# EAGLE design v1 (EAGLE 7.3.0)
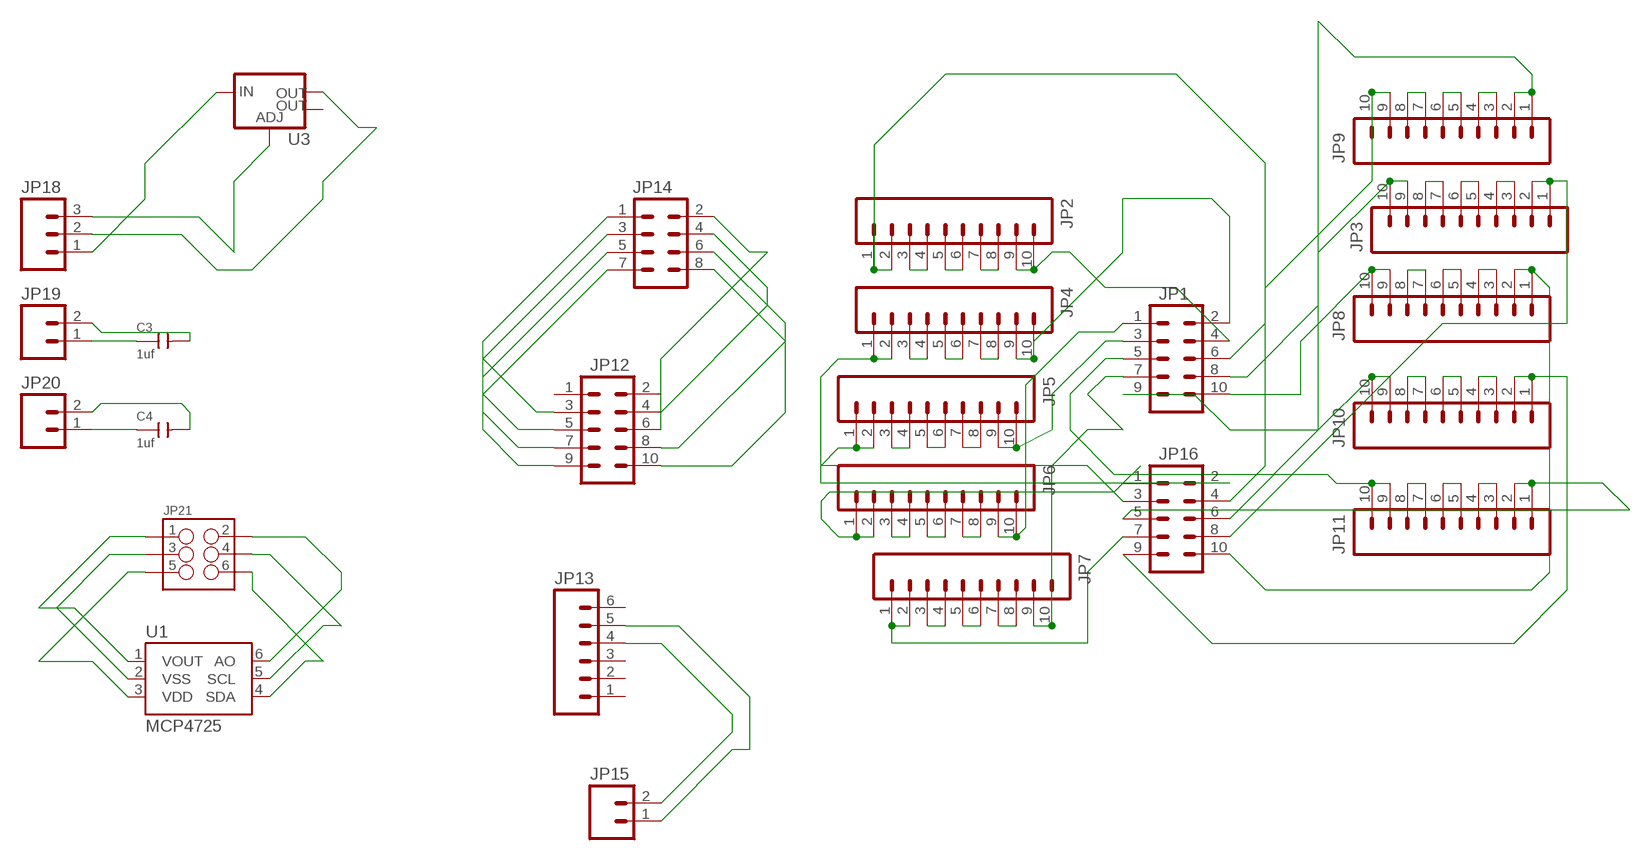
[diagram p0: schematic, sheet 1]

## Parts
C3  1uf  CERAMIC-1UF-25V-10%-X7R(0805)  [C0805]
C4  1uf  CERAMIC-1UF-25V-10%-X7R(0805)  [C0805]
JP1  M05X2PTH  [AVR_ICSP]
JP2  M10SILK_FEMALE_PTH  [1X10]
JP3  M10SILK_FEMALE_PTH  [1X10]
JP4  M10SILK_FEMALE_PTH  [1X10]
JP5  M10SILK_FEMALE_PTH  [1X10]
JP6  M10SILK_FEMALE_PTH  [1X10]
JP7  M10SILK_FEMALE_PTH  [1X10]
JP8  M10SILK_FEMALE_PTH  [1X10]
JP9  M10SILK_FEMALE_PTH  [1X10]
JP10  M10SILK_FEMALE_PTH  [1X10]
JP11  M10SILK_FEMALE_PTH  [1X10]
JP12  M05X2PTH  [AVR_ICSP]
JP13  M06SILK_FEMALE_PTH  [1X06]
JP14  M04X2  [2X4]
JP15  M02PTH  [1X02]
JP16  M05X2PTH  [AVR_ICSP]
JP18  M03PTH  [1X03]
JP19  M02PTH  [1X02]
JP20  M02PTH  [1X02]
JP21  M03X22X3_SILK_MALE_PTH  [2X3]
U1  MCP4725  MCP4725SOT-23  [SOT23-6]
U3  V_REG_LM1117SOT223  [SOT223]

## Nets
N$1: JP2.3 JP2.4
N$2: JP1.2 JP4.9 JP4.10
N$3: JP1.3 JP5.9 JP5.10
N$4: JP1.1 JP6.9 JP6.10
N$5: JP1.9 JP10.9 JP10.10
N$6: JP1.5 JP11.9 JP11.10
N$7: JP3.1 JP3.2 JP16.8
N$8: JP1.8 JP3.9 JP3.10
N$9: JP1.7 JP7.9 JP7.10
N$10: JP1.6 JP9.9 JP9.10
N$11: JP9.7 JP9.8
N$12: JP9.5 JP9.6
N$13: JP9.3 JP9.4
N$14: JP9.1 JP9.2 JP16.6
N$15: JP3.7 JP3.8
N$16: JP3.5 JP3.6
N$17: JP3.3 JP3.4
N$18: JP21.2 U1.6(AO)
N$19: JP10.1 JP10.2 JP16.9
N$20: JP8.3 JP8.4
N$21: JP8.5 JP8.6
N$22: JP8.7 JP8.8
N$23: JP11.7 JP11.8
N$24: JP11.5 JP11.6
N$25: JP11.3 JP11.4
N$26: JP6.1 JP6.2 JP16.1
N$27: JP21.4 U1.5(SCL)
N$28: JP10.3 JP10.4
N$29: JP10.5 JP10.6
N$30: JP10.7 JP10.8
N$31: JP5.7 JP5.8
N$32: JP5.5 JP5.6
N$33: JP5.1 JP5.2 JP16.3
N$34: JP5.3 JP5.4
N$35: JP21.6 U1.4(SDA)
N$36: JP6.3 JP6.4
N$37: JP6.5 JP6.6
N$38: JP6.7 JP6.8
N$39: JP7.1 JP7.2 JP16.7
N$40: JP7.3 JP7.4
N$41: JP7.5 JP7.6
N$42: JP7.7 JP7.8
N$43: JP4.1 JP4.2 JP16.2
N$44: JP4.3 JP4.4
N$45: JP4.5 JP4.6
N$46: JP4.7 JP4.8
N$47: JP11.1 JP11.2 JP16.5
N$48: JP2.7 JP2.8
N$49: JP2.5 JP2.6
N$50: JP2.1 JP2.2 JP16.4
N$51: JP1.10 JP8.9 JP8.10
N$52: JP21.5 U1.3(VDD)
N$53: JP21.3 U1.2(VSS)
N$54: JP1.4 JP2.9 JP2.10
N$55: JP13.4 JP15.2
N$56: JP13.5 JP15.1
N$57: JP12.4 JP14.2
N$58: JP12.6 JP14.4
N$59: JP12.8 JP14.6
N$60: JP12.10 JP14.8
N$61: JP12.3 JP14.1
N$62: JP12.5 JP14.3
N$63: JP12.7 JP14.5
N$64: JP12.9 JP14.7
N$65: JP21.1 U1.1(VOUT)
N$66: JP18.3 U3.1(ADJ)
N$67: JP8.1 JP8.2 JP16.10
N$68: C3.1 JP19.1
N$69: C3.2 JP19.2
N$70: C4.1 JP20.1
N$71: C4.2 JP20.2
N$72: JP18.2 U3.2(OUT)
N$73: JP18.1 U3.3(IN)
Unconnected: JP12.1 JP12.2 JP13.1 JP13.2 JP13.3 JP13.6 U3.4(OUT)

## Library data of the parts
C3 C4 = Seeed-OPL-Capacitor:CERAMIC-1UF-25V-10%-X7R(0805): 302010179; MPN: CC0805KKX7R8BB105
JP1 JP12 JP16 = SparkFun-Connectors:M05X2: Header 5x2 Standard 10-pin dual row 0.1" header. Commonly used with AVR-ISP. Use with Spark Fun Electronics SKU: PRT-00778
JP2-JP11 = SparkFun-Connectors:M10: Header 10 Standard 10-pin 0.1" header. Use with straight break away headers (SKU : PRT-00116), right angle break away headers (PRT-00553), swiss pins (PRT-00743), machine pins (PRT-00117), and female headers (PRT-00115).; PROD_ID: CONN-11563
JP13 = SparkFun-Connectors:M06: Header 6 Standard 6-pin 0.1" header. Use with straight break away headers (SKU : PRT-00116), right angle break away headers (PRT-00553), swiss pins (PRT-00743), machine pins (PRT-00117), and female headers (PRT-00115). Molex polarized connector foot print use with SKU : PRT-08094 with associated crimp pins and housings. NOTES ON THE VARIANTS LOCK and LOCK_LONGPADS... This footprint was designed to help hold the alignment of a through-hole component (i.e. 6-pin header) while soldering it into place. You may notice that each hole has been shifted either up or down by 0.005 of an inch from it's more standard position (which is a perfectly straight line). This slight alteration caused the pins (the squares in the middle) to touch the edges of the holes. Because they are alternating, it causes a "brace" to hold the component in place. 0.005 has proven to be the perfect amount of "off-center" position when using our standard breakaway headers. Although looks a little odd when you look at the bare footprint, once you have a header in there, the alteration is very hard to notice. Also,if you push a header all the way into place, it is covered up entirely on the bottom side. This idea of altering the position of holes to aid alignment will be further integrated into the Sparkfun Library for other footprints. It can help hold any component with 3 or more connection pins.; PROD_ID: CONN-08437
JP14 = SparkFun-Connectors:M04X2: .1" header, two rows of four.
JP15 JP19 JP20 = SparkFun-Connectors:M02: Standard 2-pin 0.1" header. Use with - straight break away headers ( PRT-00116) - right angle break away headers (PRT-00553) - swiss pins (PRT-00743) - machine pins (PRT-00117) - female headers (PRT-00115) Molex polarized connector foot print use with: PRT-08233 with associated crimp pins and housings. 2.54_SCREWTERM for use with PRT-10571. 3.5mm Screw Terminal footprints for PRT-08084 5mm Screw Terminal footprints for use with PRT-08432
JP18 = SparkFun-Connectors:M03: Header 3 Standard 3-pin 0.1" header. Use with straight break away headers (SKU : PRT-00116), right angle break away headers (PRT-00553), swiss pins (PRT-00743), machine pins (PRT-00117), and female headers (PRT-00115). Molex polarized connector foot print use with SKU : PRT-08232 with associated crimp pins and housings.
JP21 = SparkFun-Connectors:M03X2: 2x3 .1" header. Shrouded, with keying- CONN-10681 SMT- CONN-11415 Pogo pins- HW-11044; PROD_ID: CONN-09701
U1 = SparkFun-AnalogIC:MCP4725: Microchip 12-bit I2C DAC, SOT23-6; PROD_ID: IC-08886
U3 = SparkFun-PowerIC:V_REG_LM1117: Voltage Regulator LM1117 Standard adjustable voltage regulator but in SMD form. Spark Fun Electronics SKU : COM-00595; PROD_ID: VREG-08170

## Board
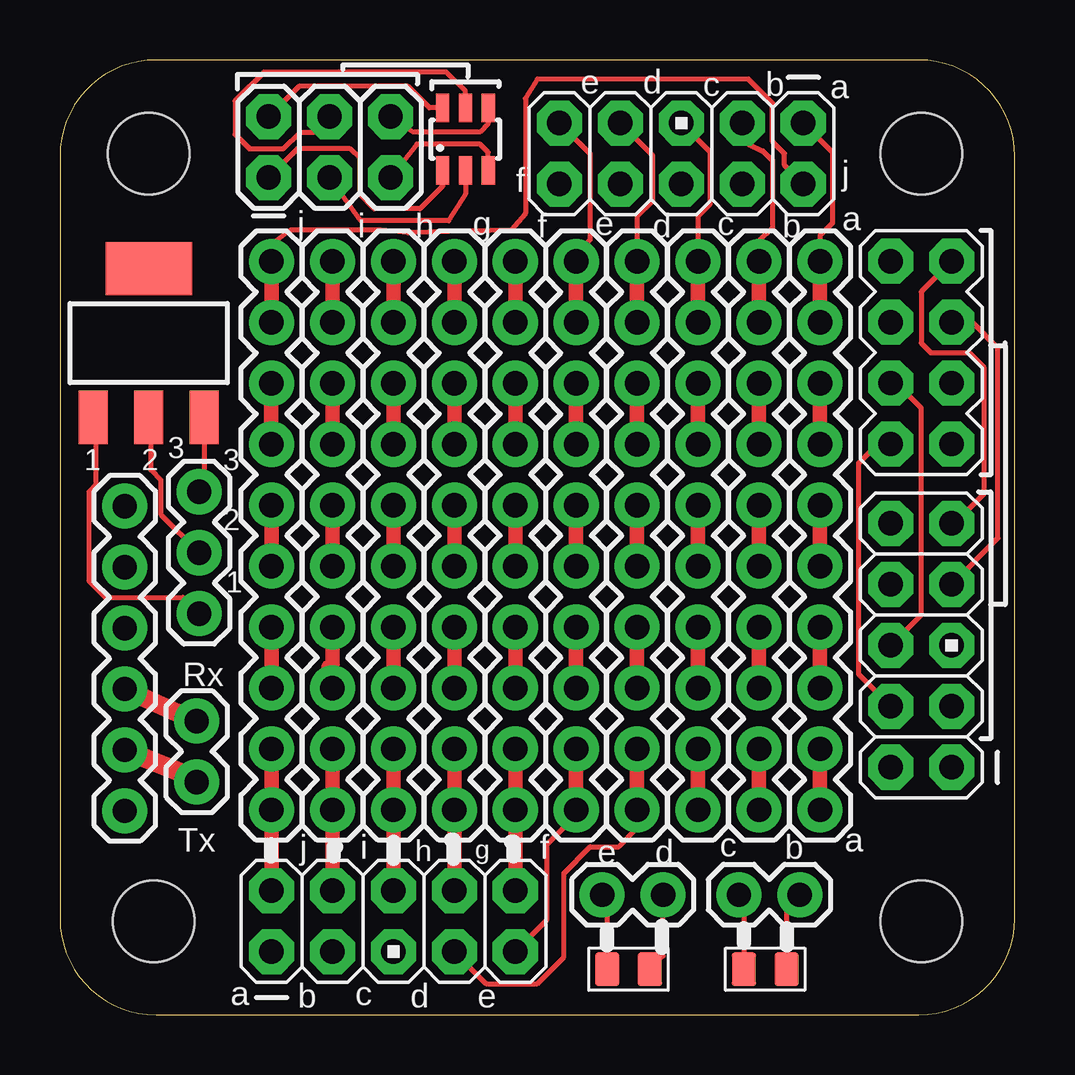
[diagram p1: board, top side]
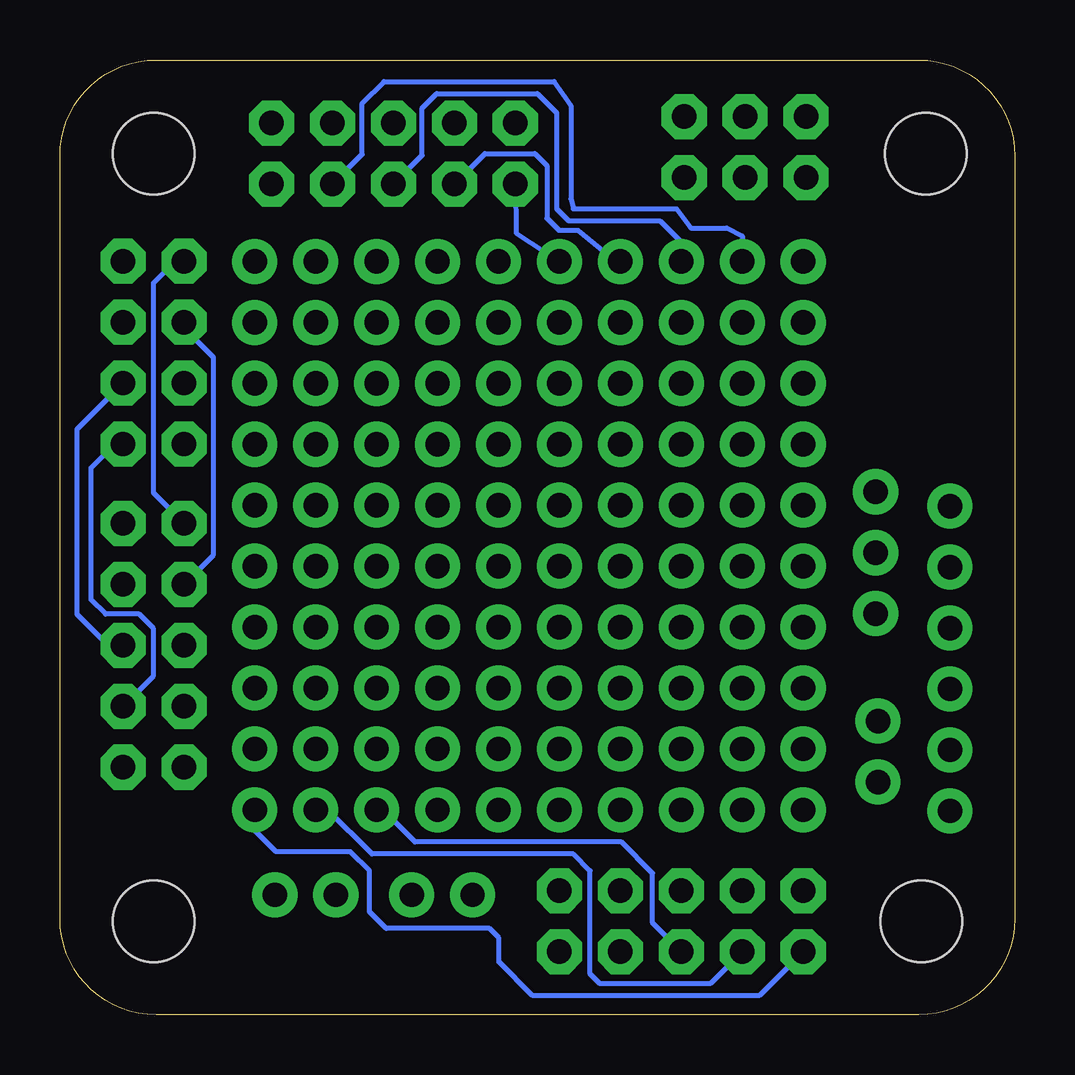
[diagram p2: board, bottom side, seen from below]

Size 39.8 x 39.8 mm. Coordinates in mm from the lower left corner, seen from the top.
Outline: 39.8,4 39.8,35.8 arc90 35.8,39.8 4,39.8 arc90 0,35.8 0,4 arc90 4,0 35.8,0 arc90 39.8,4
Copper layers (1*16): Top 0.035mm / dielectric 1.5mm / Bottom 0.035mm
Design rules "DFRobot_Eagle_Rule_v0.4": minimum track width 6mil, minimum drill 12mil, track to track 6mil, track to pad 6mil, pad to pad 6mil, via to via 6mil, smd to smd 0mil, copper to edge 10mil, drill to drill 10mil, minimum pad ring 12mil, minimum via ring 8mil, stop-mask expansion 2mil, vias tented up to drill 25mil, thermal gap 10mil
Holes 3.4 mm at 3.9,3.9 35.9,3.9 3.7,35.9 35.9,35.9

### Footprints (pad centres in the part's own frame; a part is rotated, then mirrored left to right if it is on the bottom)
C0805 = smd 1.397 x 1.016: 1 0,0.889; 2 0,-0.889
AVR_ICSP = drill 1.016 pad 1.88 octagon: 1 -1.27,5.08; 2 1.27,5.08; 3 -1.27,2.54; 4 1.27,2.54; 5 -1.27,0; 6 1.27,0; 7 -1.27,-2.54; 8 1.27,-2.54; 9 -1.27,-5.08; 10 1.27,-5.08
1X10 = drill 1.016 pad 1.88: 1 0,0; 2 2.54,0; 3 5.08,0; 4 7.62,0; 5 10.16,0; 6 12.7,0; 7 15.24,0; 8 17.78,0; 9 20.32,0; 10 22.86,0
1X06 = drill 1.016 pad 1.88: 1 0,0; 2 2.54,0; 3 5.08,0; 4 7.62,0; 5 10.16,0; 6 12.7,0
2X4 = drill 1.016 pad 1.88 octagon: 1 -3.81,-1.27; 2 -3.81,1.27; 3 -1.27,-1.27; 4 -1.27,1.27; 5 1.27,-1.27; 6 1.27,1.27; 7 3.81,-1.27; 8 3.81,1.27
1X02 = drill 1.016 pad 1.88: 1 0,0; 2 2.54,0
1X03 = drill 1.016 pad 1.88: 1 0,0; 2 2.54,0; 3 5.08,0
2X3 = drill 1.016 pad 1.88 octagon: 1 0,0; 2 0,2.54; 3 2.54,0; 4 2.54,2.54; 5 5.08,0; 6 5.08,2.54
SOT23-6 = smd 0.55 x 1.2: 1 0.95,1.3; 2 0,1.3; 3 -0.95,1.3; 4 -0.95,-1.3; 5 0,-1.3; 6 0.95,-1.3
SOT223 = smd 1.219 x 2.235: 1 -2.311,-3.099; 2 0,-3.099; 3 2.311,-3.099 | smd 3.6 x 2.2: 4 0,3.099

### Placement (x,y rotation side)
C3  29.4,1.9 90 top
C4  23.7,1.9 90 top
JP1  13.9,3.9 90 top
JP2  11.36,31.4 270 top
JP3  16.44,31.4 270 top
JP4  8.82,31.4 270 top
JP5  29.14,31.4 270 top
JP6  31.68,31.4 270 top
JP7  24.06,31.4 270 top
JP8  18.98,31.4 270 top
JP9  13.9,31.4 270 top
JP10  21.52,31.4 270 top
JP11  26.6,31.4 270 top
JP12  35.9,15.4 180 top
JP13  2.7,21.2 270 top
JP14  35.9,27.6 90 top
JP15  5.7,9.7 90 top
JP16  25.9,35.9 270 top
JP18  5.8,21.8 270 top
JP19  28.3,5 0 top
JP20  22.6,5 0 top
JP21  8.7,34.9 0 top
U1  16.9,36.5 180 top
U3  3.7,28 0 top

### Tracks (layer width: path | path; a pad name or v marks a point on that pad's centre or on a via)
N$1
  Top 0.6: JP2.3 JP2.4
N$2
  Top 0.6: JP4.9 JP4.10 JP1.2
N$3
  Top 0.6: JP5.9 JP5.10
  Bottom 0.2: JP1.3 12.69,1.3 17.3,1.3 17.7,1.7 17.7,6 18.4,6.7 26.8,6.7 28.64,8.54 JP5.10
N$4
  Top 0.6: JP6.9 JP6.10
  Bottom 0.2: JP1.1 10.65,0.8 20.1,0.8 21.5,2.2 21.5,3.2 21.9,3.6 26.2,3.6 26.9,4.3 26.9,6 27.7,6.8 30.8,6.8 31.68,7.68 JP6.10
N$5
  Top 0.2: JP1.9 20.3,3.95 20.3,7.1 21.52,8.32 JP10.10
  Top 0.6: JP10.9 JP10.10
N$6
  Top 0.6: JP11.9 JP11.10
  Bottom 0.2: JP1.5 15.1,3.83 15.1,5.9 16.4,7.2 25,7.2 26.34,8.54 JP11.10
N$7
  Top 0.6: JP3.1 JP3.2
  Bottom 0.2: JP16.8 22.09,35.9 20,35.9 19.5,35.4 19.5,33.2 19,32.7 18.2,32.7 16.6,31.4 JP3.1
N$8
  Top 0.6: JP3.9 JP3.10 JP1.8
N$9
  Top 0.2: JP1.7 17.77,1.3 19.9,1.3 21,2.4 21,5.9 22.1,7 23.3,7 24.06,7.76 JP7.10
  Top 0.6: JP7.9 JP7.10
N$10
  Top 0.6: JP1.6 JP9.10 JP9.9
N$11
  Top 0.6: JP9.7 JP9.8
N$12
  Top 0.6: JP9.5 JP9.6
N$13
  Top 0.6: JP9.3 JP9.4
N$14
  Top 0.6: JP9.1 JP9.2
  Bottom 0.2: JP16.6 24.7,35.83 24.7,37.8 24.1,38.4 19.9,38.4 19.1,37.6 19.1,33.6 18.6,33.1 14.8,33.1 13.9,32.2 JP9.1
N$15
  Top 0.6: JP3.8 JP3.7
N$16
  Top 0.6: JP3.5 JP3.6
N$17
  Top 0.6: JP3.3 JP3.4
N$18
  Top 0.2: U1.6 15.4,37.8 14.5,38.7 9.96,38.7 JP21.2
N$19
  Top 0.2: JP16.9 22.1,35.89 22.1,32.3 21.52,31.72 JP10.1
  Top 0.6: JP10.1 JP10.2
N$20
  Top 0.6: JP8.3 JP8.4
N$21
  Top 0.6: JP8.5 JP8.6
N$22
  Top 0.6: JP8.7 JP8.8
N$23
  Top 0.6: JP11.8 JP11.7
N$24
  Top 0.6: JP11.5 JP11.6
N$25
  Top 0.6: JP11.3 JP11.4
N$26
  Top 0.2: JP16.1 32.2,35.95 32.2,33 31.68,32.48 JP6.1
  Top 0.6: JP6.1 JP6.2
N$27
  Top 0.2: U1.5 16.9,38.5 16.1,39.3 8.5,39.3 7.3,38.1 7.3,36.7 7.9,36.1 9.3,36.1 10,36.8 10.6,36.8 JP21.4
N$28
  Top 0.6: JP10.3 JP10.4
N$29
  Top 0.6: JP10.6 JP10.5
N$30
  Top 0.6: JP10.8 JP10.7
N$31
  Top 0.6: JP5.7 JP5.8
N$32
  Top 0.6: JP5.5 JP5.6
N$33
  Top 0.2: JP16.3 28.7,36.3 29.31,36 29.7,35.61 29.7,32.8 29.14,32.24 JP5.1
  Top 0.6: JP5.1 JP5.2
N$34
  Top 0.6: JP5.4 JP5.3
N$35
  Top 0.2: U1.4 17.85,37.15 17.5,36.8 14.72,36.8 JP21.6
N$36
  Top 0.6: JP6.3 JP6.4
N$37
  Top 0.6: JP6.6 JP6.5
N$38
  Top 0.6: JP6.8 JP6.7
N$39
  Top 0.2: JP16.7 24.7,35.83 24.7,33.9 24.06,33.26 JP7.1
  Top 0.6: JP7.1 JP7.2
N$40
  Top 0.6: JP7.3 JP7.4
N$41
  Top 0.6: JP7.5 JP7.6
N$42
  Top 0.6: JP7.7 JP7.8
N$43
  Top 0.2: JP16.2 30.2,35.41 30.2,35.9 29.7,36.4 29.7,38 28.7,39 19.9,39 19.4,38.2 19.4,33.4 18.8,32.7 14.5,32.6 13.4,32.7 9.6,32.7 8.82,32.12 JP4.1
  Top 0.6: JP4.1 JP4.2
N$44
  Top 0.6: JP4.3 arc90 8.8,26.3 8.8,24.3 arc-90 8.82,24.28 JP4.4
N$45
  Top 0.6: JP4.5 JP4.6
N$46
  Top 0.6: JP4.7 JP4.8
N$47
  Top 0.2: JP16.5 27.1,35.97 27.1,33.8 26.6,33.3 JP11.1
  Top 0.6: JP11.1 JP11.2
N$48
  Top 0.6: JP2.8 arc-90 11.2,13.78 11.2,14.5 arc90 11.36,14.66 JP2.7
N$49
  Top 0.6: JP2.5 JP2.6
N$50
  Top 0.6: JP2.2 JP2.1
  Bottom 0.2: JP16.4 27.2,35.87 27.2,38 26.3,38.9 19.2,38.9 18.5,37.9 18.5,34 18.4,33.6 14.1,33.6 13.5,32.8 12,32.8 11.36,32.46 JP2.1
N$51
  Top 0.6: JP1.10 JP8.10 JP8.9
N$52
  Top 0.2: U1.3 17.85,35.95 17.5,36.3 14.88,36.3 JP21.5
N$53
  Top 0.2: U1.2 16.9,34.2 16.2,33.1 12.54,33.1 JP21.3
N$54
  Top 0.6: JP2.9 JP2.10 JP1.4
N$55
  Top 0.8: JP13.4 5.14,12.48 JP15.2
N$56
  Top 0.8: JP13.5 4.94,10.14 JP15.1
N$57
  Top 0.2: JP12.4 33.3,14.19 33.3,23 34.09,23.79 JP14.2
N$58
  Top 0.2: JP12.6 35.9,16.67 35.9,25.3 34.87,26.33 JP14.4
N$59
  Bottom 0.2: JP12.8 33.4,19.17 33.4,27.4 34.63,28.63 JP14.6
N$60
  Bottom 0.2: JP12.10 35.9,21.75 35.9,30.5 34.99,31.41 JP14.8
N$61
  Bottom 0.2: JP12.3 35.9,14.13 35.9,16.1 36.5,16.7 37.9,16.7 38.5,17.3 38.5,22.8 37.51,23.79 JP14.1
N$62
  Bottom 0.2: JP14.3 39.1,24.4 39.1,16.7 37.8,15.4 JP12.5
N$63
  Top 0.2: JP12.7 39.1,19.87 39.1,27.8 38.03,28.87 JP14.5
N$64
  Top 0.2: JP14.7 35.9,30.14 35.9,28 36.3,27.6 37.9,27.6 38.5,27 38.5,21.7 37.28,20.48 JP12.9
N$65
  Top 0.2: U1.1 15.95,34.55 15,33.6 13.1,33.6 12.5,34.2 12.5,35.7 12.1,36.1 9.9,36.1 JP21.1
N$66
  Top 0.2: JP18.3 5.12,17.4 1.9,17.4 1.2,18.1 1.2,21.8 1.51,22.11 1.51,25.39 1.4,25.5 1.4,24.91 U3.1
N$67
  Top 0.6: JP8.1 JP8.2
  Bottom 0.2: JP16.10 20.78,32.59 JP8.1
N$68
  Top 0.2: JP19.1 28.51,4.79 C3.1
N$69
  Top 0.2: JP19.2 30.29,4.45 C3.2
N$70
  Top 0.2: JP20.1 22.81,4.79 C4.1
N$71
  Top 0.2: C4.2 25.14,2.45 JP20.2
N$72
  Top 0.2: JP18.2 4.2,20.86 4.2,22.3 3.8,22.7 3.8,24.8 U3.2
N$73
  Top 0.2: U3.3 6.01,22.01 JP18.1

### Text on the board
tPlace: 1 | 2 | 3 | 3 | 2 | 1
tNames: e | d | c | b | a | j | f | j | g | e | c | a | i | h | f | d | b | Rx | Tx | j | i | g | f | c | b | a | h | e | d | a | b | c | d | e